# EAGLE board 200W_4FET_Load_v11 (EAGLE 6.1)
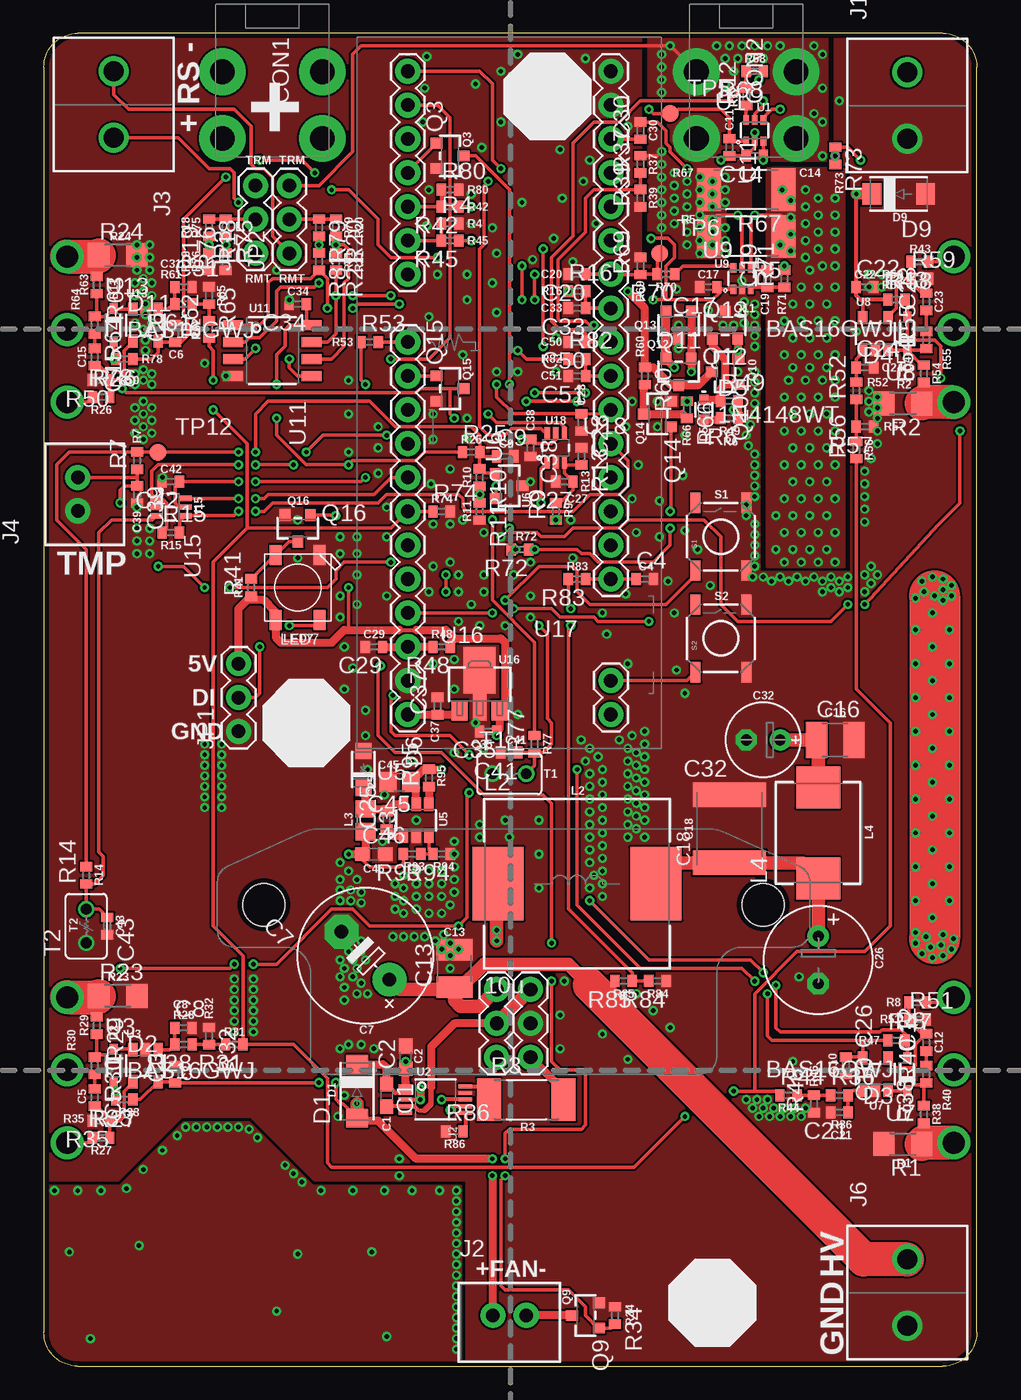
[diagram p1: board, top side]
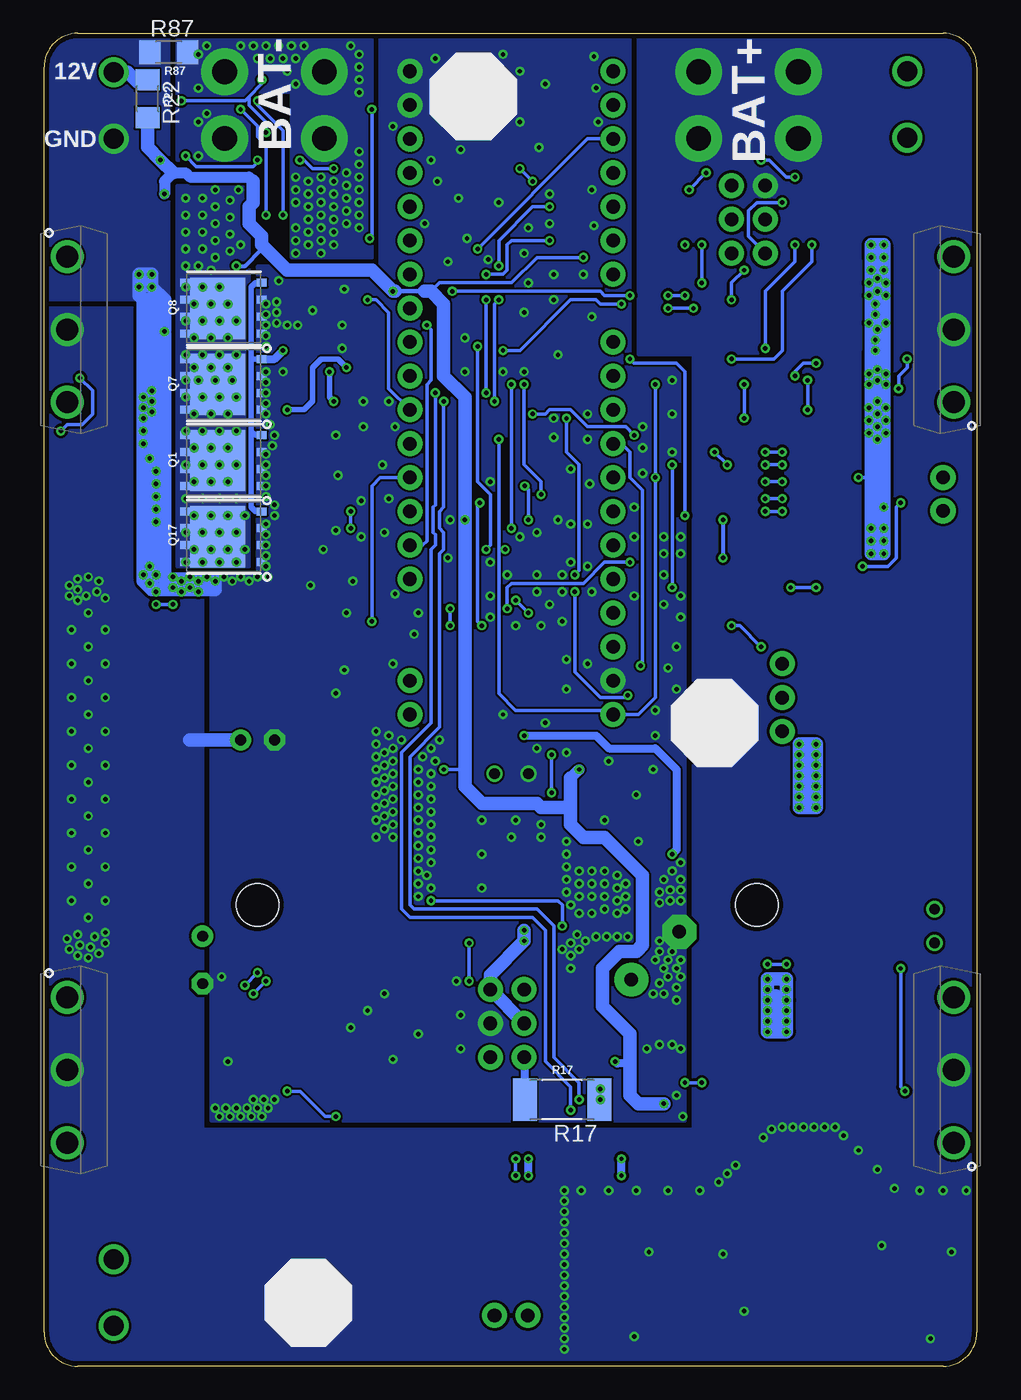
[diagram p2: board, bottom side, seen from below]

Size 70 x 100 mm. Coordinates in mm from the lower left corner, seen from the top.
Outline: 2.54,0 67.46,0 arc90 70,2.54 70,97.46 arc90 67.46,100 2.54,100 arc90 0,97.46 0,2.54 arc90 2.54,0
Copper layers (1*16): Top 0.0356mm / dielectric 1.5011mm / Bottom 0.0356mm
Design rules: minimum track width 6mil, minimum drill 13mil, track to track 6mil, track to pad 6mil, pad to pad 6mil, via to via 6mil, smd to smd 6mil, copper to edge 15mil, drill to drill 6mil, minimum pad ring 7mil, minimum via ring 7mil, stop-mask expansion 4mil, vias tented up to drill 20mil, thermal gap 10mil
Net classes: 1 100v: clearance 0.203 mm
Holes 3.17 mm at 37.78,95.25 19.68,48.26 50.16,4.76
tRestrict: area 47,1.6 to 53.3,7.9; area 16.5,45.1 to 22.9,51.4; area 34.6,92.1 to 41,98.4
bRestrict: area 47,1.6 to 53.3,7.9; area 16.5,45.1 to 22.9,51.4; area 34.6,92.1 to 41,98.4

## Footprints (pad centres in the part's own frame; a part is rotated, then mirrored left to right if it is on the bottom)
C0603 = smd 1.1 x 1: 1 -0.85,0; 2 0.85,0
C0402 = smd 0.7 x 0.9: 1 -0.65,0; 2 0.65,0
E5-10,5 = drill 1.016 pad 2.54: + -2.54,0 | drill 1.016 pad 2.54 octagon: - 2.54,0
C1210 = smd 1.6 x 2.7: 1 -1.4,0; 2 1.4,0
C2220K = smd 1.85 x 5.5: 1 -2.55,0; 2 2.55,0
E3,5-8 = drill 0.813 pad 1.6: + -1.778,0 | drill 0.813 pad 1.6 octagon: - 1.778,0
E2,5-6E = drill 0.813 pad 1.575: + -1.27,0 | drill 0.813 pad 1.575 octagon: - 1.27,0
C0805 = smd 1.3 x 1.5: 1 -0.85,0; 2 0.85,0
M4_RA_SOLDTERM = drill 1.85 pad 3.5: P$1 -2.5,3.745; P$2 2.5,3.745; P$3 2.5,-3.745; P$4 -2.5,-3.745
SMA = smd 1.4 x 1.64: A -2.015,0; K 2.015,0
SOD323 = smd 0.6 x 0.8: A 0,-1.25; K 0,1.25
SOD523 = smd 0.7 x 0.8: A 0,-0.75; K 0,0.75
SOD123W = smd 1.2 x 1.2: A -1.4,0; K 1.4,0
PHOENIXCONTACT1935161 = drill 1.5: 1 0,0; 2 5,0
B2B-XH-A = drill 1.016 pad 1.88: 1 -2.5,0; 2 0,0
DUAL_D2PAK_DB = drill 1.016 pad 1.88: D1 -1.27,2.54; D2 1.27,2.54; G1 -1.27,-2.54; G2 1.27,-2.54; S1 -1.27,0; S2 1.27,0 | hole 3.175: -18.733,8.89; 18.733,8.89
1X03 = drill 1.016 pad 1.88: 1 0,0; 2 2.54,0; 3 5.08,0
INDUCTOR_13.8X12.7 = smd 3.85 x 5.5: 1 -5.925,0; 2 5.925,0
0805 = smd 1.3 x 1.5: 1 -0.85,0; 2 0.85,0
INDUCTOR_7.4X6.6MM = smd 3.15 x 3.3: 1 -3.425,0; 2 3.425,0
WS2812B = smd 1.5 x 0.9: 1-VDD 2.45,-1.65; 2-DOUT 2.45,1.65; 3-GND -2.45,1.65; 4-DIN -2.45,-1.65
DFN5X6-8L = smd 0.6 x 0.75: 1 -1.905,-2.855; 2 -0.635,-2.855; 3 0.635,-2.855; 4 1.905,-2.855; EP-TL -0.635,2.895; EP-TLL -1.905,2.895; EP-TR 0.635,2.895; EP-TRR 1.905,2.895 | smd 4.6 x 4.12: EP 0,0.46
TO-247 = drill 1.65: 1 -5.46,0; 2 0,0; 3 5.46,0
SOT23 = smd 0.8 x 0.9: 1 0.95,1; 2 -0.95,1; 3 0,-1
R1206 = smd 1.6 x 1.803: 1 -1.422,0; 2 1.422,0
R2512 = smd 1.8 x 3.2: 1 -2.8,0; 2 2.8,0
R0402 = smd 0.7 x 0.9: 1 -0.65,0; 2 0.65,0
TACTILE_SWITCH_SMD = smd 1.524 x 0.762: 1 -2.54,1.905; 2 2.54,1.905; 3 -2.54,-1.905; 4 2.54,-1.905
THERMISTOR_3MMX3MM = drill 0.813: 1 -1.27,0; 2 1.27,0
TPAD_MED_ROUND = smd 1.27 x 1.27: 1 0,0
SOT-363 = smd 0.42 x 0.7: 1 -0.65,-0.8; 2 0,-0.8; 3 0.65,-0.8; 4 0.65,0.8; 5 0,0.8; 6 -0.65,0.8
10-TSSOP = smd 0.3 x 1: 1 -1,-2.25; 2 -0.5,-2.25; 3 0,-2.25; 4 0.5,-2.25; 5 1,-2.25; 6 1,2.25; 7 0.5,2.25; 8 0,2.25; 9 -0.5,2.25; 10 -1,2.25
SOT23-5 = smd 0.7 x 1: 1 0.95,1.2; 2 0,1.2; 3 -0.95,1.2; 4 -0.95,-1.2; 5 0.95,-1.2
SOT23-6 = smd 0.7 x 1: 1 -0.95,-1.2; 2 0,-1.2; 3 0.95,-1.2; 4 0.95,1.2; 5 0,1.2; 6 -0.95,1.2
8-SOIC = smd 0.75 x 1.5: 1 -1.905,-2.95; 2 -0.635,-2.95; 3 0.635,-2.95; 4 1.905,-2.95; 5 1.905,2.95; 6 0.635,2.95; 7 -0.635,2.95; 8 -1.905,2.95
SC70-6 = smd 0.4 x 0.9: 1 -0.65,-1.1; 2 0,-1.1; 3 0.65,-1.1; 4 0.65,1.1; 5 0,1.1; 6 -0.65,1.1
SOT-89 = smd 1.2 x 1.5: 1 -1.5,0; 3 1.5,0 | smd 1 x 2: 2 0,0.25 | smd 2.4 x 3.5: 2@1 0,3
STM32_BLUE_PILL_USABLE = drill 1.016 pad 1.88: 3V3 -7.62,-19.05; 3V3_2 7.62,24.13; 5V 7.62,19.05; A0 -7.62,13.97; A1 -7.62,11.43; A2 -7.62,8.89; A3 -7.62,6.35; A4 -7.62,3.81; A5 -7.62,1.27; A6 -7.62,-1.27; A7 -7.62,-3.81; A8 7.62,-13.97; A9 7.62,-11.43; A10 7.62,-8.89; A12 7.62,-3.81; A15 7.62,-1.27; B0 -7.62,-6.35; B1 -7.62,-8.89; B3 7.62,1.27; B4 7.62,3.81; B5 7.62,6.35; B6 7.62,8.89; B7 7.62,11.43; B8 7.62,13.97; B9 7.62,16.51; B10 -7.62,-11.43; B11 -7.62,-13.97; B12 7.62,-24.13; B13 7.62,-21.59; B14 7.62,-19.05; B15 7.62,-16.51; C13 -7.62,21.59; GND -7.62,-24.13; GND2 -7.62,-21.59; GND4 7.62,21.59; RST -7.62,-16.51; VBAT -7.62,24.13

## Placement (x,y rotation side)
C1  1u  [C0603]  25.72,20.32 270 top
C2  100n  [C0603]  27.15,23.18 90 top
C3  1u  [C0402]  9.84,21.91 90 top
C4  100n  [C0402]  45.09,59.05 0 top
C5  4.7n  [C0402]  3.81,20.16 270 top
C6  1u  [C0402]  9.84,77.47 90 top
C7  100u  [E5-10,5]  24.13,30.8 135 top
C8  100n  [C0402]  10.48,25.4 0 top
C9  1u  [C0402]  34.61,68.26 0 top
C10  1u  [C0402]  60.17,22.54 270 top
C11  1u  [C0402]  51.44,91.44 270 top
C12  4.7n  [C0402]  66.2,24.29 90 top
C13  2.2u  [C1210]  30.8,29.84 90 top
C14  1u  [C0402]  53.34,90.81 180 top
C15  4.7n  [C0402]  3.81,75.72 270 top
C16  2.2u  [C1210]  59.37,46.99 0 top
C17  1u  [C0402]  49.85,80.96 180 top
C18  10u  [C2220K]  51.44,40.32 90 top
C19  1u  [C0402]  54.29,81.6 90 top
C20  30n  [C0402]  40.01,81.92 180 top
C21  100n  [C0402]  59.69,19.05 180 top
C22  1u  [C0402]  61.59,80.96 0 top
C23  4.7n  [C0402]  66.2,79.85 90 top
C24  100n  [C0402]  61.59,74.93 0 top
C25  100n  [C0402]  25.72,40.96 90 top
C26  47u  [E3,5-8]  58.1,30.48 270 top
C27  1u  [C0402]  39.05,66.36 180 top
C28  4.7u  [C0402]  40.32,70.8 270 top
C29  1u  [C0402]  24.77,53.98 180 top
C30  1u  [C0402]  44.77,92.71 90 top
C31  100n  [C0402]  10.48,80.96 0 top
C32  22u  [E2,5-6E]  53.98,46.99 180 top
C33  100n  [C0402]  40.01,79.38 180 top
C34  1u  [C0402]  19.05,79.69 180 top
C35  1u  [C0402]  33.34,47.62 180 top
C37  1u  [C0402]  29.53,49.53 90 top
C38  1u  [C0402]  36.51,68.9 270 top
C39  1u  [C0402]  6.99,65.41 270 top
C41  1u  [C0402]  34.92,46.04 180 top
C42  DNI  [C0402]  9.53,66.36 180 top
C43  DNI  [C0402]  4.76,33.02 270 top
C45  22u  [C0805]  26.67,43.81 180 top
C46  22u  [C0603]  24.77,38.42 0 top
C50  30n  [C0402]  40.01,76.83 180 top
C51  100n  [C0402]  40.01,74.3 180 top
CON1  SOLDER_LUG  [M4_RA_SOLDTERM]  17.14,94.61 270 top
CON2  SOLDER_LUG  [M4_RA_SOLDTERM]  52.7,94.61 270 top
D1  SS54  [SMA]  23.5,20.64 90 top
D2  BAS16GWJ  [SOD323]  5.24,22.54 0 top
D3  BAS16GWJ  [SOD323]  64.77,21.91 180 top
D4  BAS16GWJ  [SOD323]  64.77,77.47 180 top
D5  1N4148WT  [SOD523]  49.53,71.75 0 top
D6  B5819W  [SOD123W]  23.97,44.77 270 top
D9  SS54  [SMA]  64.14,87.95 180 top
D11  BAS16GWJ  [SOD323]  5.24,78.11 0 top
J1  M02PT  [PHOENIXCONTACT1935161]  64.77,92.08 90 top
J2  M02  [B2B-XH-A]  36.2,3.81 0 top
J3  M02PT  [PHOENIXCONTACT1935161]  5.24,97.16 270 top
J4  M02  [B2B-XH-A]  2.54,66.67 90 top
J5  DUAL_D2PAK_DB  [DUAL_D2PAK_DB]  35.24,25.72 0 top
J6  M02PT  [PHOENIXCONTACT1935161]  64.77,3.02 90 top
JP1  [1X03]  14.61,47.62 90 top
JP2  [1X03]  18.41,83.5 90 top
JP3  [1X03]  15.88,83.5 90 top
L2  10u  [INDUCTOR_13.8X12.7]  40.01,36.2 0 top
L3  4.7u  [0805]  24.13,40.96 270 top
L4  1.5u  [INDUCTOR_7.4X6.6MM]  58.1,40.01 90 top
LED7  WS2812B  [WS2812B]  19.05,58.42 270 top
Q1  NCEP0160G  [DFN5X6-8L]  56.52,67.94 90 bottom
Q2  IRFP260N  [TO-247]  68.26,77.79 270 bottom
Q3  2N7002P  [SOT23]  30.48,90.81 90 top
Q4  IRFP260N  [TO-247]  68.26,22.23 270 bottom
Q5  IRFP260N  [TO-247]  1.75,22.23 90 bottom
Q6  IRFP260N  [TO-247]  1.75,77.79 90 bottom
Q7  NCEP0160G  [DFN5X6-8L]  56.52,73.66 90 bottom
Q8  NCEP0160G  [DFN5X6-8L]  56.52,79.38 90 bottom
Q9  2302  [SOT23]  40.64,3.81 270 top
Q10  8050M  [SOT23]  51.12,74.61 270 top
Q11  8550M  [SOT23]  51.12,78.11 180 top
Q12  8050M  [SOT23]  47.62,74.61 0 top
Q13  8550M  [SOT23]  47.62,78.11 0 top
Q14  2N7002P  [SOT23]  46.04,71.44 270 top
Q15  2N7002P  [SOT23]  30.48,73.34 90 top
Q16  2N7002P  [SOT23]  19.05,62.87 0 top
Q17  NCEP0160G  [DFN5X6-8L]  56.52,62.23 90 bottom
R1  5m  [R1206]  64.45,16.67 180 top
R2  5m  [R1206]  64.45,72.23 180 top
R3  7.5  [R2512]  36.2,20 0 top
R4  10k  [R0402]  30.48,85.72 0 top
R5  2m  [R2512]  52.7,84.77 180 top
R6  56  [R0402]  51.44,71.12 180 top
R7  10k  [R0402]  6.99,67.94 90 top
R8  750  [R0402]  65.56,27.3 180 top
R9  30k  [R0402]  38.42,64.14 90 top
R10  1.5k  [R0402]  32.7,66.67 270 top
R11  1.1k  [R0402]  32.7,64.14 270 top
R12  8.2k  [R0402]  52.7,95.25 90 top
R13  10k  [R0402]  40.32,68.26 270 top
R14  10k  [R0402]  3.17,36.83 90 top
R15  0  [R0402]  9.53,62.55 0 top
R16  1.6k  [R0402]  40.01,80.64 0 top
R17  7.5  [R2512]  31.11,20 180 bottom
R18  430k  [R0402]  12.38,85.41 270 top
R19  150k  [R0402]  12.38,82.87 90 top
R20  430k  [R0402]  21.91,85.41 270 top
R21  150k  [R0402]  21.91,82.87 270 top
R22  5A  [R1206]  62.23,95.09 270 bottom
R23  5m  [R1206]  5.56,27.78 0 top
R24  5m  [R1206]  5.56,83.34 0 top
R25  120  [R0402]  32.07,68.58 0 top
R26  750  [R0402]  4.29,72.71 0 top
R27  750  [R0402]  4.29,17.14 0 top
R28  10k  [R0402]  10.48,24.13 180 top
R29  10k  [R0402]  3.97,25.56 270 top
R30  10k  [R0402]  3.81,22.54 270 top
R31  30k  [R0402]  14.29,24.13 180 top
R32  510  [R0402]  12.38,24.77 270 top
R33  10k  [R0402]  6.03,20 180 top
R34  10k  [R0402]  42.86,3.81 270 top
R35  10k  [R0402]  4.29,18.41 180 top
R36  10k  [R0402]  59.69,20.32 0 top
R37  270k  [R0402]  44.77,90.17 90 top
R38  10k  [R0402]  66.04,18.89 90 top
R39  10k  [R0402]  44.77,87.63 90 top
R40  10k  [R0402]  66.2,21.91 90 top
R41  510  [R0402]  15.56,58.42 90 top
R42  0  [R0402]  30.48,87 180 top
R43  750  [R0402]  65.72,82.87 180 top
R44  30k  [R0402]  55.88,20.32 0 top
R45  0  [R0402]  30.48,84.45 180 top
R46  510  [R0402]  57.78,19.68 90 top
R47  10k  [R0402]  63.98,24.45 0 top
R48  10  [R0402]  29.84,53.98 180 top
R49  560  [R0402]  51.44,72.39 0 top
R50  10k  [R0402]  4.29,73.98 180 top
R51  10k  [R0402]  65.56,26.04 0 top
R52  10k  [R0402]  60.96,73.18 90 top
R53  1.6k  [R0402]  24.45,76.83 0 top
R54  10k  [R0402]  66.04,74.45 90 top
R55  10k  [R0402]  66.2,76.99 90 top
R56  30k  [R0402]  60.96,68.74 90 top
R57  510  [R0402]  61.59,70.48 180 top
R58  10k  [R0402]  63.98,80.01 0 top
R59  10k  [R0402]  65.72,81.6 0 top
R60  560  [R0402]  45.09,74.3 270 top
R61  10k  [R0402]  10.48,79.69 180 top
R62  30k  [R0402]  12.38,77.79 90 top
R63  10k  [R0402]  3.97,81.12 270 top
R64  10k  [R0402]  3.81,78.11 270 top
R65  510  [R0402]  12.38,80.33 270 top
R66  120  [R0402]  48.26,71.75 270 top
R67  2m  [R2512]  52.7,88.27 180 top
R68  15k  [R0402]  53.34,97.16 180 top
R69  15k  [R0402]  44.77,82.55 90 top
R70  8.2k  [R0402]  46.67,81.92 180 top
R71  1.5k  [R0402]  55.56,81.6 90 top
R72  10k  [R0402]  35.72,61.28 180 top
R73  1.5k  [R0402]  59.37,90.81 270 top
R74  10k  [R0402]  29.84,64.14 0 top
R75  4.3M  [R0402]  13.65,85.41 270 top
R76  150k  [R0402]  13.65,82.87 90 top
R77  10k  [R0402]  36.83,46.67 90 top
R78  10k  [R0402]  6.03,75.56 180 top
R79  4.3M  [R0402]  20.64,85.41 270 top
R80  10k  [R0402]  30.48,88.27 0 top
R81  150k  [R0402]  20.64,82.87 270 top
R82  1.6k  [R0402]  40.01,75.56 0 top
R83  1.6k  [R0402]  40.01,59.05 180 top
R84  10k  [R0402]  46.04,28.89 180 top
R85  270k  [R0402]  43.5,28.89 180 top
R86  47k  [R0402]  30.8,17.62 0 top
R87  10k  [R1206]  60.64,98.58 0 bottom
R93  51k  [R0402]  27.62,38.42 180 top
R94  10k  [R0402]  29.84,38.42 180 top
R95  150k  [R0402]  28.89,44.13 90 top
S1  [TACTILE_SWITCH_SMD]  50.8,62.23 90 top
S2  [TACTILE_SWITCH_SMD]  50.8,54.61 90 top
T1  NTC3MM  [THERMISTOR_3MMX3MM]  34.92,44.45 0 top
T2  NTC3MM  [THERMISTOR_3MMX3MM]  3.17,33.02 90 top
TP5  TPADMED_ROUND  [TPAD_MED_ROUND]  46.99,93.98 0 top
TP6  TPADMED_ROUND  [TPAD_MED_ROUND]  46.2,83.5 0 top
TP12  TPADMED_ROUND  [TPAD_MED_ROUND]  8.57,68.58 0 top
U1  NCS199A2  [SOT-363]  53.34,92.71 0 top
U2  LM5106  [10-TSSOP]  29.37,20 270 top
U3  LM321-TR  [SOT23-5]  7.62,22.54 0 top
U5  MP2359  [SOT23-6]  27.94,40.96 0 top
U6  TL431SOT23  [SOT23]  34.92,66.04 90 top
U7  LM321-TR  [SOT23-5]  62.39,21.91 180 top
U8  LM321-TR  [SOT23-5]  62.39,77.47 180 top
U9  NCS199A3  [SOT-363]  52.39,81.6 0 top
U11  MCP6002SOIC  [8-SOIC]  17.14,76.2 270 top
U13  LM321-TR  [SOT23-5]  7.62,78.11 0 top
U15  DNI  [SC70-6]  9.53,64.45 270 top
U16  3.3V  [SOT-89]  32.7,49.21 0 top
U17  STM32_BLUE_PILL  [STM32_BLUE_PILL_USABLE]  34.92,73.03 180 top
U18  74LVC1G3157  [SC70-6]  38.42,68.9 0 top

## Tracks (layer width: path | path; a pad name or v marks a point on that pad's centre or on a via)
2V495  (via drill 0.33)
  Top 0.254: C9.1 33.03,68.26 R25.2 | U6.2 v33.92,66.04 U6.1 33.04,66.99 R10.1 32.7,68.58 R25.2 | R14.2 3.17,61.28 0.95,63.5 0.95,67.63 1.91,68.58 6.97,68.58 R7.2 8.56,68.59 TP12.1 v14.61,68.58 | R77.2 36.83,54.29 33.66,57.47 v33.66,63.5 | v15.88,68.58 15.88,71.44 16.83,72.39 24.45,72.39 26.35,70.48 32.07,70.48 32.72,69.83 R25.2
  Bottom 0.254: v33.66,63.5 33.66,65.77 v33.92,66.04 | v14.61,68.58 v15.88,68.58
3V3  (via drill 0.33)
  Top 0.254: U15.5 10.16,64.45 9.84,64.77 9.84,66.03 C42.1 v14.61,66.36 | U18.5 38.42,69.53 38.1,69.22 36.84,69.22 C38.1 35.89,69.55 v35.88,69.53 | R53.1 23.8,73.99 v24.13,73.66 | v15.88,66.36 23.81,66.36 v24.13,66.67 | R72.2 v35.4,61.28
  Top 0.61: U17.3V3_2 29.51,48.9 C37.1 30.87,48.88 U16.1
  Bottom 0.254: v35.88,69.53 35.88,61.28 | v14.61,66.36 v15.88,66.36 | v24.13,73.66 v24.13,66.67 24.13,50.16 25.4,48.9 U17.3V3_2 27.62,49.21 34.61,49.21 35.88,50.48 35.88,60.96 35.88,61.28 | v35.4,61.28 35.88,61.28
3V3-2
  Top 0.254: C30.1 42.56,92.06 U17.3V3
5V  (via drill 0.33)
  Top 0.254: R93.2 26.97,37.77 26.67,37.47 24.45,37.47 23.91,38 C46.1 | C34.1 19.7,78.5 U11.8 18.41,78.11 18.1,77.79 18.1,76.52 17.46,75.88 v17.46,73.66 | v17.46,71.12 17.46,69.85 19.68,67.63 v22.86,67.63 23.18,67.94 27.94,67.94 28.57,68.58 R25.1 | v22.86,58.42 22.86,55.24 | 15.56,57.78 R41.1
  Top 0.305: 26.67,55.24 27.94,55.24
  Top 0.61: L3.2 24.13,38.63 C46.1 v22.86,38.42 | R48.1 30.5,54.31 30.8,54.61 | 30.8,54.61 34.29,54.61 34.61,54.29 34.61,49.62 U16.3 34.2,47.84 C35.1 33.99,47.32 v33.97,47.31 | 26.67,55.24 22.86,55.24 22.54,55.24 21.59,54.29 17.78,54.29 17.4,54.67 LED7.1-VDD 17.4,56.58 16.51,57.47 15.26,57.47 | 27.94,55.24 30.16,55.24 30.8,54.61 | JP1.3 14.61,56.83 15.24,57.47 15.26,57.47 | 15.26,57.47 R41.1
  Bottom 0.254: v17.46,73.66 v17.46,71.12 | v22.86,67.63 v22.86,58.42
  Bottom 0.61: v33.97,47.31 28.57,47.31 27.62,46.35 24.13,46.35 22.54,44.77 22.54,38.73 v22.86,38.42
5V_USB
  Top 0.61: R48.2 U17.5V C29.1
7V4_SNS
  Top 0.254: R9.2 38.75,64.78 39.7,65.74 C27.1 39.07,66.99 U18.3 39.25,67.61 R13.2
12V  (via drill 0.33)
  Top 0.254: R73.1 60.31,91.45 v61.28,90.49 | D1.A 22.43,19.68 22.23,19.68 21.91,20 v21.91,21.27 | R47.1 61.44,24.45 | 61.44,24.45 54.61,24.45 54.29,24.77 v54.29,27.94 | v53.34,28.89 52.39,29.84 44.77,29.84 40.01,34.61 v40.01,44.77 | v13.65,89.22 10.48,86.04 10.48,78.9 10.79,78.58 10.79,77.31 10.3,76.82 C6.1 8.65,76.82 U13.5 | v16.19,90.49 19.37,90.49 v20.32,89.53 | v21.59,88.27 22.86,88.27 25.08,86.04 25.08,84.14 26.04,83.19 v29.53,83.19 | R9.1 v38.42,63.5 | 9.84,21.27 10.16,21.27 | 10.16,21.27 v20.64,21.27 | U13.5 8.49,76.91 | R78.1 8.1,75.56 8.57,76.04 U13.5 | 10.16,21.27 10.14,21.26 C3.1 9.76,21.34 U3.5 7.23,20 R33.1 | C10.1 61.35,23.19 U7.5 61.44,24.45 | U8.5 61.44,79.85 61.59,80.01 | C22.1 60.95,81.27 60.96,81.28 | R58.1 63.18,80.01
  Top 0.305: R71.2 v55.56,82.55 | 63.18,80.01 61.59,80.01 61.28,80.01 60.96,80.33 60.96,81.28 v60.96,87.95 | U2.1 27.12,21.09 27.15,21.27
  Top 0.61: Q10.3 49.12,73.61 Q12.3 47.04,73.61 45.7,74.94 R60.1 45.09,79.38 v43.81,80.64 | U5.5 27.94,43.4 C45.1 28.49,44.78 R95.2 29.83,44.78 v29.84,44.77 | J2.1 33.7,14.25 v33.66,14.29 | v33.66,15.56 27.94,15.56 25.08,18.41 23.7,18.41 D1.A | 27.15,21.27 C2.1 | C2.1 27.15,22.38 | v27.15,22.86 C2.1
  Top 0.813: D9.K v60.96,87.95
  Top 1.016: v23.5,19.68 D1.A
  Bottom 0.254: v20.64,21.27 v21.91,21.27 | v54.29,27.94 v53.34,28.89 | v13.65,89.22 14.29,89.22 15.56,90.49 v16.19,90.49 | v20.32,89.53 v21.59,88.27 | v29.53,83.19 33.02,83.19 34.92,81.28 40.32,81.28 40.96,80.64 | v40.01,44.77 38.42,44.77
  Bottom 0.305: v55.56,82.55 54.93,82.55 53.66,83.82 53.66,84.14
  Bottom 0.356: 43.66,80.64 41.43,80.64
  Bottom 0.61: v33.66,14.29 v33.66,15.56 | 26.04,20.32 26.04,22.54 26.19,22.7 26.99,22.7 v27.15,22.86
  Bottom 0.813: 54.29,88.9 54.61,89.22 59.05,89.22 59.37,89.53 60.33,89.53 60.96,88.9 v60.96,87.95 | 30.48,44.13 v29.84,44.77
  Bottom 1.016: R22.2 62.23,91.44 v61.28,90.49 60.33,89.53 | 54.29,88.9 54.29,87.31 54.61,87 54.61,85.72 53.66,84.77 53.66,84.14 51.75,82.23 45.4,82.23 v43.81,80.64 43.66,80.64 | 41.43,80.64 40.96,80.64 40.01,79.69 40.01,74.3 38.42,72.71 v38.42,63.5 38.42,44.77 38.42,43.5 37.15,42.23 33.02,42.23 32.7,41.91 30.48,41.91 | v23.5,19.68 25.4,19.68 26.04,20.32 26.04,24.92 28.1,26.99 28.1,29.84 26.83,31.11 25.56,31.11 25.08,31.59 25.08,36.83 27.94,39.69 29.53,39.69 30.48,40.64 30.48,41.91 | 30.48,41.91 30.48,44.13
A0
  Top 0.254: R83.1 U17.A0 C4.1
AUX_SNS  (via drill 0.33)
  Top 0.254: R15.2 10.18,63.35 U15.4 14.27,63.8 v14.61,64.14 | v15.88,64.14 16.51,64.14 17.14,64.77 25.08,64.77 25.72,65.41 31.11,65.41 31.43,65.09 31.43,64.45 31.75,64.14 39.69,64.14 40.96,65.41 43.18,65.41 43.81,66.04 43.81,67.94 U17.A4
  Bottom 0.254: v14.61,64.14 v15.88,64.14
AUX_SNS_INT  (via drill 0.33)
  Top 0.254: U15.1 8.88,65.1 9.21,64.77 9.21,62.87 R15.1 | U18.4 39.07,70.47 38.73,70.8 33.97,70.8 v33.34,71.44 | v25.72,69.85 20.95,69.85 v19.68,68.58 | v18.73,67.63 v15.88,67.63 | v14.61,67.63 8.57,67.63 8.1,67.15 8.1,65.43 U15.1 | 8.26,65.27 U15.1
  Bottom 0.254: v25.72,69.85 26.35,70.48 29.21,70.48 30.48,71.75 32.07,71.75 32.38,71.44 v33.34,71.44 | v19.68,68.58 v18.73,67.63 | v15.88,67.63 v14.61,67.63
BASE1  (via drill 0.33)
  Top 0.61: Q13.1 Q12.1 48.58,76.52 v48.58,74.61 | v48.26,72.39 R66.1
  Bottom 0.406: v48.58,74.61 48.58,72.71 v48.26,72.39
BASE2
  Top 0.61: D5.K 50.67,72.5 R49.1 50.78,73.33 51.12,73.66 | Q10.1 51.12,73.66 | Q11.1 50.17,76.52 51.12,75.56 51.12,73.67 51.12,73.66
BEN  (via drill 0.33)
  Top 0.254: v40.64,73.03 v36.83,73.03 | v36.83,80.01 v36.83,81.92 | v32.07,84.45 R45.1
  Top 0.305: U2.7 30.77,19.5 v30.48,19.21
  Bottom 0.254: v30.48,19.21 30.48,20.95 32.38,22.86 32.38,32.7 33.34,33.66 42.55,33.66 43.18,34.29 43.18,46.04 40.96,48.26 40.96,61.28 40.64,61.59 40.64,62.39 40.8,62.55 40.8,64.45 40.64,64.61 v40.64,73.03 | v36.83,73.03 v36.83,80.01 | v36.83,81.92 35.56,81.92 35.24,82.23 35.24,84.14 34.92,84.45 v32.07,84.45
C1+  (via drill 0.33)
  Top 1.016: L4.2 58.1,46.86 C16.1 C32.+
  Top 3.81: v66.83,57.78 66.83,32.07
  Bottom 1.016: C32.+ 59.05,46.99
  other vias: 0.79,13.18 10.64,17.94 11.43,17.94 12.22,17.94 13.02,17.94 13.81,17.94 14.61,17.94 15.4,17.78 16.03,17.14 10,17.3 2.54,13.18 4.29,13.18 6.19,13.34 7.46,14.76 8.89,16.19 18.1,15.08 18.73,14.45 19.37,13.81 20.8,13.18 23.18,13.18 25.56,13.18 27.62,13.18 29.69,13.18 30.96,13.18 30.96,12.38 30.96,11.59 30.96,10.79 30.96,10 30.96,9.21 30.96,8.41 30.96,7.62 30.96,6.83 30.96,6.03 30.96,5.24 30.96,4.45 30.96,3.65 30.96,2.86 30.96,2.06 30.96,1.27 25.72,2.22 3.49,2.06 1.91,8.57 24.61,8.57 7.14,9.05 17.46,4.13 19.05,8.41 65.41,31.75 65.88,30.96 66.67,30.64 67.47,30.8 68.1,31.27 68.26,32.07 65.41,32.54 66.52,31.43 67.31,31.59 66.2,32.23 67.47,32.38 66.67,33.66 67.94,34.92 65.41,34.92 66.67,36.2 66.67,38.73 66.67,41.27 66.67,43.81 66.67,46.35 66.67,48.9 66.67,51.44 66.67,53.98 66.67,56.52 67.94,37.47 65.41,37.47 65.41,40.01 67.94,40.01 67.94,42.55 65.41,42.55 65.41,45.09 67.94,45.09 67.94,47.62 65.41,47.62 65.41,50.16 67.94,50.16 67.94,52.7 65.41,52.7 65.41,55.24 67.94,55.24 65.41,57.63 68.1,57.78 66.67,59.21 65.88,58.9 67.47,59.05 66.04,58.1 67.47,57.47 67.47,58.26 68.1,58.58
  pour Bottom (no thermals): 0,100.01 25.4,100.01 25.4,75.88 21.27,75.88 21.27,17.78 58.1,17.78 58.1,65.09 60.64,65.09 60.64,79.38 70.17,79.38 70.17,0 0,0
  pour Top: 0,13.49 5.71,13.49 10.48,18.26 15.4,18.26 20.16,13.49 31.27,13.49 31.27,0 0,0
C1-  (via drill 0.33)
  Top 0.254: U9.5 52.39,86.04 v52.07,86.36 50.48,86.36 | U1.5 53.34,93.98 53.98,94.61 v53.98,94.93 | JP2.3 20.64,88.58 23.18,91.12 23.18,98.42 23.81,99.06 47.02,99.06 CON2.P$4 | R37.2 46.05,90.82 v46.35,91.12
  Bottom 0.254: v53.98,94.93 53.98,94.61 52.07,92.71 v52.07,86.36
  other vias: 51.12,83.5 51.12,84.45 51.12,85.41 51.12,87.31 51.12,88.27 51.12,89.22 50.16,88.9 50.16,87.95 50.16,87 50.16,84.14 50.16,85.09 50.16,86.04 49.21,83.5 49.21,84.45 49.21,85.41 49.21,86.36 49.21,87.31 49.21,88.27 49.21,89.22 48.26,84.14 48.26,85.09 48.26,86.04 48.26,87 48.26,87.95 48.26,88.9 47.31,85.72 47.31,86.68 47.31,87.63 47.31,88.58 47.31,89.53 46.35,85.41 46.35,86.36 46.35,87.31 46.35,88.27 46.35,89.22 46.35,90.17 46.35,95.57 46.35,96.52 46.35,97.47 46.35,98.42 46.99,99.06 50.48,99.06 51.44,99.06 52.39,99.06 53.34,99.06 54.29,99.06 55.24,99.06 57.78,99.06 58.42,98.42 58.42,95.89 58.42,93.34 58.42,90.81 57.78,93.98 51.12,98.11 52.07,98.11 53.02,98.11 53.98,98.11 51.75,97.16 51.12,96.2
  pour Top (no thermals): 45.4,100.01 58.74,100.01 58.74,90.49 54.61,90.49 54.61,95.57 53.02,95.57 53.02,87 51.12,87 51.12,83.19 45.4,83.19
  pour Bottom (no thermals): 45.4,100.01 60.01,100.01 60.01,90.49 54.61,90.49 54.61,95.57 51.44,95.57 51.44,83.19 45.4,83.19
C1-R  (via drill 0.33)
  Top 0.254: U9.4 53.04,86.06 v53.34,86.36 55.24,86.36 | U1.4 53.99,93.68 54.61,94.3 v55.24,94.3
  Bottom 0.254: v55.24,94.3 53.98,93.03 53.98,92.23 53.34,91.6 v53.34,86.36
  other vias: 57.15,88.27 59.37,87.63 57.15,87 59.37,86.36 57.15,85.72 59.37,85.09 57.15,84.45 59.37,83.82 57.15,83.19 59.37,82.55 58.42,82.55 58.1,83.82 58.1,85.09 58.1,86.36 58.1,87.63 56.2,66.36 57.47,66.36 55.56,67.63 56.83,67.63 58.1,67.63 56.2,68.9 57.47,68.9 56.83,70.17 58.1,70.17 55.56,70.17 56.2,71.44 57.47,71.44 58.1,72.71 56.83,72.71 55.56,72.71 55.88,73.98 57.15,73.98 56.2,74.93 55.56,78.42 56.83,78.42 58.1,78.42 56.2,79.69 57.47,79.69 56.83,80.96 58.1,80.96 58.74,79.69 58.42,73.98 58.74,71.44 58.74,68.9 58.74,66.36 57.47,82.23 59.37,80.96 59.37,78.42 56.2,77.15 57.47,77.15 58.74,77.15 56.83,75.88 58.1,75.88 59.37,75.88 55.56,75.88 57.47,74.93 58.74,74.93 59.37,73.98 59.37,72.71 59.37,70.17 59.37,67.63 54.93,63.82 56.2,63.82 57.47,63.82 58.74,63.82 55.56,65.09 56.83,65.09 58.1,65.09 59.37,65.09 54.93,61.28 56.2,61.28 57.47,61.28 58.74,61.28 55.56,62.55 56.83,62.55 58.1,62.55 59.37,62.55 55.56,60.33 56.83,60.33 58.1,60.33 59.37,60.33 56.04,83.66 56.04,84.93 56.04,86.2 56.04,87.47 55.4,88.27 55.24,84.14
  pour Bottom (no thermals): 54.61,88.58 60.01,88.58 60.01,60.01 54.61,60.01
  pour Top (no thermals): 54.29,89.85 60.01,89.85 60.01,60.01 54.29,60.01
C1A
  Top 0.254: C20.1 U17.B1 42.56,81.9 R69.1 44.78,81.92 R70.2 46.04,81.93 46.04,83.34 TP6.1
C1A_HI
  Top 0.254: U17.A7 C50.1 40.64,76.85 40.64,77.47 40.32,77.79 38.73,77.79 38.1,78.42 38.1,83.19 39.69,84.77 39.69,91.76 41.27,93.34 43.18,93.34 44.77,94.93 51.44,94.93 52.4,95.9 R12.2 52.69,95.92 R68.2
C1CCPWM  (via drill 0.33)
  Top 0.254: R74.1 U17.B6 26.04,62.87 15.24,62.87 | 15.24,62.87 12.7,60.33 12.7,33.02 14.94,30.78 R31.1 18.73,24.13 21.27,21.59 21.27,15.24 21.59,14.92 44.29,14.92 v48.1,18.73 | 15.24,62.87 15.24,69.22 v12.7,71.75 | v12.7,73.98 12.7,76.2 12.38,76.52 R62.1 | v51.75,20.64 53.34,20.64 | 53.34,20.64 54.91,20.64 R44.1 | R56.1 60.96,50.8 63.5,48.26 63.5,33.02 61.59,31.11 56.52,31.11 53.34,27.94 53.34,20.64
  Bottom 0.254: v12.7,71.75 v12.7,73.98 | v48.1,18.73 48.9,18.73 50.8,20.64 v51.75,20.64
C1CCSET1
  Top 0.254: C24.1 R52.2 60.96,75.56 61.44,76.04 U8.1
C1CCSET2
  Top 0.254: R36.2 | C21.1 R36.2 | U7.1 60.73,20.71 R36.2
C1CCSET3
  Top 0.254: R28.2 | C8.1 R28.2 | U3.1 9.44,23.74 R28.2
C1CCSET4
  Top 0.254: R61.2 | C31.1 R61.2 | U13.1 9.3,79.31 9.68,79.69 R61.2
C1DFB1
  Top 0.254: R54.1 66.04,72.4 R2.1
  Top 2.54: Q2.3 65.97,72.33 R2.1
C1DFB2
  Top 0.254: R38.1 66.04,16.83 R1.1
  Top 2.54: Q4.3 65.97,16.77 R1.1
C1DFB3
  Top 0.254: R29.1 3.97,27.62 R23.1
  Top 2.54: Q5.3 4.04,27.68 R23.1
C1DFB4
  Top 0.254: R24.1 4.13,81.94 R63.1
  Top 2.54: Q6.3 4.04,83.25 R24.1
C1DOFF  (via drill 0.33)
  Top 0.254: v61.59,57.15 67.15,63.18 68.74,64.77 v68.74,70.17 | v34.92,73.66 34.92,88.27 32.38,90.81 Q3.3 | v34.92,62.87 35.24,62.55 36.99,62.55 37.31,62.23 39.05,62.23 39.69,62.87 43.18,62.87 43.81,63.5 49.53,63.5 50.8,62.23 50.8,57.15 52.07,55.88 59.05,55.88 v60.33,57.15 | v67.31,74.14 67.31,76.52 66.83,76.99 65.09,76.99 64.77,77.31 D4.A 64.77,79.87 R58.2
  Bottom 0.254: v61.59,57.15 v60.33,57.15 | v34.92,62.87 v34.92,73.66 | v68.74,70.17 68.26,70.64 67.15,70.64 66.36,71.44 66.36,73.18 v67.31,74.14
C1DOFFG
  Top 0.254: U17.B15 27.3,89.58 Q3.1
C1FET  (via drill 0.33)
  Top 0.61: Q11.2 v52.07,76.2 52.07,75.61 Q10.2
  Bottom 0.406: Q8.4 54.13,81.28 54.45,80.96 54.45,75.56 | Q7.4 54.45,75.56 | 54.45,70.17 54.45,75.56 | Q1.4 54.13,69.85 54.45,70.17 | 54.45,70.17 54.45,64.45 54.13,64.14 Q17.4
  Bottom 0.61: Q7.4 52.7,75.56 v52.07,76.2
C1NGATE1
  Top 0.254: R59.1 R43.2 | C23.2 65.87,80.5 65.07,81.3 R59.1 | U8.4 63.34,78.74 63.98,79.38 63.98,81.28 64.29,81.6 R59.1
C1NGATE2
  Top 0.254: R8.2 R51.1 64.91,25.89 65.87,24.94 C12.2 66.2,24.92 65.41,24.13 65.41,22.54 65.25,22.38 63.98,22.38 63.34,23.02 U7.4
C1NGATE3
  Top 0.254: R27.2 R35.1 | C5.2 3.98,19.51 4.94,18.56 R35.1 | U3.4 6.67,21.27 6.03,20.64 6.03,18.73 5.71,18.41 R35.1
C1NGATE4
  Top 0.254: U13.4 6.67,76.84 6.03,76.2 6.03,74.45 5.56,73.98 R50.1 | R50.1 R26.2 | C15.2 4.14,75.07 4.76,74.45 4.76,74.15 R50.1
C1ON  (via drill 0.33)
  Top 0.254: v37.47,83.82 v37.47,76.52 | v46.99,62.87 46.99,61.59 45.72,60.33 41.59,60.33 40.96,60.96 40.32,60.96 40.01,61.28 v36.83,61.28 R72.1 | v46.99,64.14 47.04,64.14 Q14.1
  Top 0.61: 47.01,70.45 Q14.1
  Bottom 0.254: U17.B14 29.21,92.08 v37.47,83.82 | v37.47,76.52 37.47,66.36 36.51,65.41 36.51,61.59 v36.83,61.28 | v46.99,62.87 v46.99,64.14
C1R  (via drill 0.33)
  Top 0.254: R37.1 R39.2 44.77,88.27 41.27,88.27 40.64,87.63 40.64,85.09 38.58,83.03 38.58,78.58 38.73,78.42 40.64,78.42 40.96,78.11 v41.27,78.11
  Bottom 0.254: U17.A1 41.59,61.59 41.27,61.91 41.27,73.66 40.96,73.98 40.96,77.79 v41.27,78.11
C1TH  (via drill 0.33)
  Top 0.254: R7.1 6.99,66.67 | 6.99,66.67 C39.1 6.97,66.04 6.03,66.04 5.71,65.72 v5.71,64.77 | J4.2 6.99,66.67 | v35.24,56.83 38.1,56.83 38.73,56.2 41.27,56.2 41.59,55.88 v45.4,55.88 | v26.04,60.33 22.54,60.33 21.91,59.69 21.91,59.05 21.27,58.42 v13.97,58.42 | v12.06,58.42 10.48,60.01 v8.57,60.01
  Bottom 0.254: U17.A3 44.77,66.67 45.4,66.04 v45.4,55.88 | v35.24,56.83 35.24,58.42 34.92,58.74 29.53,58.74 27.94,60.33 v26.04,60.33 | v13.97,58.42 v12.06,58.42 | v5.71,64.77 6.03,64.45 6.03,60.64 6.67,60.01 v8.57,60.01
C1V
  Top 0.254: U17.B0 C33.1 R16.2
C1V_HI
  Top 0.254: R82.2 C51.1 U17.A6
C1V_OA  (via drill 0.33)
  Top 0.254: R21.2 v21.91,80.33 21.91,77.47 21.27,76.83 U11.7 | R16.1 v39.37,80.64 | v26.04,80.33 v23.18,80.33
  Bottom 0.254: v39.37,80.64 28.26,80.64 27.94,80.33 v26.04,80.33 | v23.18,80.33 v21.91,80.33
C1V_OA1  (via drill 0.33)
  Top 0.254: R82.1 36.2,75.56 v35.56,76.2 | v26.67,79.69 23.5,79.69 v23.18,79.38 | v21.27,79.38 21.27,81.58 R81.2 20.02,81.6 17.14,81.6 16.83,81.28 16.83,78.74 16.19,78.11 U11.1
  Bottom 0.254: v35.56,76.2 34.29,76.2 30.48,80.01 28.57,80.01 28.26,79.69 v26.67,79.69 | v23.18,79.38 v21.27,79.38
C1VFBN
  Top 0.254: R64.2 C15.1 3.81,76.2
C1VFBN1
  Top 0.254: R30.2 C5.1
C1VFBN2
  Top 0.254: C12.1 R40.2
C1VFBN3
  Top 0.254: R55.2 C23.1
C2DOFF  (via drill 0.33)
  Top 0.254: v5.87,73.34 6.19,73.03 27.94,73.03 28.26,73.34 30.48,73.34 | v5.71,29.84 13.97,29.84 v14.29,30.16 | v15.72,30.16 17.46,30.16 21.59,34.29 23.18,34.29 24.45,33.02 v31.11,33.02 31.75,33.66 31.75,42.86 v31.91,43.02 | v40.96,34.92 45.4,30.48 53.02,30.48 v53.98,29.53 | Q15.3 30.48,73.34 | 30.48,73.34 30.48,71.44 v30.8,71.12 | v30.16,59.37 v30.16,58.1 | v31.91,45.88 30.48,47.31 26.35,47.31 26.04,47.62 26.04,50.16 v26.19,50.32 | v54.93,28.57 54.93,25.4 55.24,25.08 62.71,25.08 62.87,25.24 64.29,25.24 64.77,24.77 64.77,24.43 | D11.A 5.24,75.71 R78.2 5.38,75.42 v5.24,75.56 | R33.2 5.38,20.65 | D2.A 5.38,21.15 5.38,20.65 | 5.38,20.65 v5.4,20.64 | D3.A 64.77,24.43 | 64.77,24.43 R47.2
  Bottom 0.254: v14.29,30.16 v15.72,30.16 | v31.11,33.02 31.11,34.61 31.43,34.92 v40.96,34.92 | v53.98,29.53 v54.93,28.57 | v30.8,71.12 30.8,68.58 29.84,67.63 29.84,59.69 v30.16,59.37 | v30.16,58.1 30.16,52.07 28.26,50.16 26.35,50.16 v26.19,50.32 | v31.91,45.88 v31.91,43.02 | v5.24,75.56 5.24,74.93 5.87,74.3 v5.87,73.34 | v5.71,29.84 5.71,20.95 v5.4,20.64
C2DOFFG
  Top 0.254: U17.A15 Q15.1
DI  (via drill 0.33)
  Top 0.254: Q16.1 21.86,63.87 v21.91,63.82 | v26.04,75.56 28.89,75.56 30.48,77.15 30.48,93.66 29.53,94.61 U17.B13
  Bottom 0.254: v21.91,63.82 21.91,74.61 22.54,75.25 25.72,75.25 v26.04,75.56
DI1
  Top 0.254: Q16.3 18.39,61.87 LED7.4-DIN 17.36,60.87 R41.2
DI2  (via drill 0.33)
  Top 0.254: v18.41,55.56 20.32,55.56 20.7,55.94 LED7.2-DOUT | v16.19,53.98 16.19,50.48 15.88,50.16 JP1.2
  Bottom 0.254: v18.41,55.56 17.78,55.56 v16.19,53.98
FANON  (via drill 0.33)
  Top 0.254: R34.2 42.56,2.86 Q9.1 | Q9.1 41.59,2.86 | 41.59,2.86 40.64,3.81 40.64,4.45 39.37,5.71 34.61,5.71 34.29,6.03 34.29,13.97 v34.61,14.29 | Q9.1 41.59,2.86 | v34.61,15.56 34.61,17.46 34.92,17.78 40.32,17.78 40.64,18.1 40.64,21.91 40.32,22.23 38.73,22.23 38.1,22.86 v38.1,28.89 | v38.1,31.75 38.1,42.23 37.47,42.86 33.02,42.86 29.84,46.04 26.35,46.04 25.08,47.31 25.08,52.39 v25.24,52.55
  Bottom 0.254: v34.61,14.29 v34.61,15.56 | v38.1,28.89 v38.1,31.75 | U17.B4 26.67,69.22 26.04,68.58 26.04,66.67 25.08,65.72 25.08,52.7 v25.24,52.55
GND  (via drill 0.33)
  Top 0.254: 51.45,90.81 C14.2 53.34,91.45 U1.2 v53.34,92.55 | 51.45,90.81 C11.2 | R68.1 53.99,96.85 v53.66,96.52 | U11.4 14.2,74.2 v13.65,74.3 | C34.2 18.4,80 v18.41,80.01 | 51.45,90.81 51.12,90.81 v50.8,90.49 | v48.26,89.85 46.99,91.12 46.99,91.44 46.67,91.76 46.67,92.71 46.04,93.34 44.77,93.34 | C42.2 v8.89,66.67
  Top 0.305: C19.2 53.67,82.25 53.66,82.23
  Bottom 0.254: v53.66,96.52 53.66,96.2 54.61,95.25 | 54.61,95.25 54.61,94.61 53.34,93.34 v53.34,92.55 | 54.61,95.25 54.93,94.93 v59.69,94.93 | v13.65,74.3 13.65,74.61 13.02,75.25 v12.06,75.25 | v18.41,80.01 18.41,81.28 v17.46,82.23 | v50.8,90.49 50.48,90.49 49.85,89.85 v48.26,89.85 | v8.89,66.67 8.26,66.67 7.94,75.88 | 61.91,79.69 61.59,79.69 v60.96,77.63 | v61.91,73.18 62.07,73.18 61.91,73.66
  Bottom 0.305: v19.05,63.5 v19.05,60.64
  Bottom 0.61: v26.67,14.29 v26.67,15.56
  Bottom 0.813: v61.91,80.96 v62.87,80.96
  Bottom 1.016: v6.99,83.19 v7.94,83.19 | v7.94,83.19 v7.94,84.14 v6.99,84.14 v6.99,83.19 | v6.99,83.19 v6.99,64.45 v6.99,61.91 | v6.99,61.91 v6.99,60.96 v7.94,60.96 v7.94,61.91 | v6.99,61.91 v7.94,61.91 | v7.94,61.91 7.94,75.88 | 60.96,70.8 v60.96,77.63 60.96,80.01 v61.91,80.96 v61.91,81.92 v62.87,81.92 v62.87,80.96 62.87,80.33 62.55,80.01 | 60.96,70.8 v62.55,70.17 v62.55,69.22 | v62.55,69.22 62.55,58.9 61.91,58.26 | v62.55,69.22 62.55,80.01 | v62.55,69.22 60.96,70.8 | 60.96,70.8 60.96,59.05 57.15,59.05 57.15,58.26 61.91,58.26 | 61.91,69.53 61.91,58.26 | 12.7,46.67 v13.34,46.67 v13.34,41.91 12.7,41.91 | 12.7,41.91 v12.06,41.91 v12.06,46.67 12.7,46.67 | 12.7,46.67 12.7,41.91 | 62.55,80.01 62.23,80.01 61.91,79.69 61.91,73.66 v61.91,73.18 61.91,70.8 | v7.94,83.19 7.94,76.04 | v15.72,25.88 v15.72,29.05 v14.29,29.05 v14.29,27.46 v14.29,25.08 v15.72,25.08 v15.72,25.88 | 15.08,27.78 15.08,25.72 15.56,25.72 v15.72,25.88
  other vias: 22.86,73.98 22.86,71.44 29.21,69.53 29.21,71.44 44.45,27.94 27.94,40.96 25.4,39.37 46.04,72.39 46.04,70.48 47.62,78.11 50.96,78.11 28.89,88.27 32.07,87.95 30.48,67.31 25.08,66.99 25.72,64.45 43.81,93.03 39.69,82.87 38.42,77.15 38.42,74.61 35.56,74.61 33.97,74.61 35.24,59.37 36.51,66.36 31.43,63.5 32.07,85.72 33.66,85.41 35.88,87.31 33.97,79.06 33.97,83.5 33.66,81.28 31.75,81.92 31.75,80.01 31.43,75.88 28.89,78.74 29.53,81.92 40.96,90.49 39.05,28.89 38.73,26.35 38.73,23.81 41.91,24.92 45.72,26.67 46.99,25.4 43.81,23.02 25.08,70.48 22.86,68.58 25.08,68.9 31.75,71.12 22.07,18.73 22.54,20.32 34.29,93.34 34.29,97.16 40.64,98.11 35.56,98.42 36.51,57.78 36.51,56.2 41.91,56.52 39.69,60.64 36.51,60.33 34.29,62.23 33.02,59.37 33.02,62.55 31.11,59.37 30.48,60.33 30.48,63.18 29.21,63.18 29.21,60.01 25.72,62.23 28.89,58.1 25.72,57.78 31.11,58.1 33.02,58.1 32.07,57.15 31.11,55.88 34.61,55.56 30.8,53.02 30.8,50.8 29.21,52.7 35.56,48.9 33.02,46.35 32.38,48.26 30.8,46.04 27.62,45.4 24.29,44.77 24.13,47.31 24.13,49.21 25.56,42.86 22.54,50.8 23.18,52.39 22.54,53.98 22.23,56.2 22.23,57.78 22.23,60.96 23.5,60.96 23.5,62.23 23.5,59.37 23.5,57.15 22.23,62.23 54.29,20 53.5,20 53.66,18.73 54.45,18.73 55.56,19.37 54.77,19.37 53.98,19.37 56.67,29.21 52.7,20 53.18,19.37 55.24,18.73 56.04,18.73 57.15,19.37 56.83,18.73 56.36,19.37 43.81,39.69 43.81,40.64 43.81,41.59 43.81,42.55 43.81,43.5 43.81,44.45 43.81,45.4 43.81,46.35 43.18,46.99 44.13,47.31 44.45,46.04 44.45,45.09 44.45,44.13 44.45,43.18 44.45,42.23 44.45,41.27 44.45,40.32 45.09,39.69 45.09,40.96 45.09,41.91 45.09,42.86 45.09,43.81 45.09,44.77 45.09,45.72 45.09,46.67 45.09,47.62 41.91,35.24 41.91,36.2 41.91,37.15 41.91,38.1 41.91,39.05 41.91,40.01 41.91,40.96 41.91,41.91 41.91,42.86 41.91,43.81 41.91,44.77 41.59,45.72 40.96,46.35 40.32,46.99 40.96,44.45 40.96,43.5 40.96,42.55 40.96,41.59 40.96,40.64 40.96,39.69 40.96,38.73 40.96,37.78 41.27,36.83 40.96,35.88 40.64,45.4 37.15,40.96 37.15,35.88 37.15,38.42 32.7,40.64 34.61,40.96 32.7,39.69 34.92,39.69 30.8,39.37 30.8,38.42 30.8,37.47 30.8,36.51 30.8,35.56 29.84,37.15 29.84,36.2 29.84,35.24 30.48,34.61 29.84,33.97 28.89,33.97 28.89,35.24 28.89,36.2 28.89,37.15 27.94,37.15 26.99,36.83 27.94,36.2 27.94,35.24 27.94,34.29 26.99,33.97 26.99,34.92 26.99,35.88 26.35,36.2 26.35,35.24 26.35,34.29 26.19,32.23 26.99,32.23 28.57,32.23 29.37,31.91 30.48,31.75 31.11,31.27 30.48,30.8 29.84,31.27 30,32.38 27.78,32.23 30.48,29.84 23.81,31.91 22.54,28.42 22.54,27.46 23.5,27.94 23.81,31.11 22.86,31.11 22.23,30.48 23.18,30.48 24.13,30.48 24.29,27.94 23.5,29.84 22.54,29.84 22.23,29.21 23.18,29.21 23.81,28.73 24.77,23.81 23.81,24.13 22.86,24.13 22.23,23.81 23.81,34.77 22.23,35.72 22.23,34.92 23.02,34.92 23.81,35.56 23.02,35.72 22.23,36.51 23.5,36.51 22.86,37.15 22.23,37.78 13.34,45.88 13.34,45.09 13.34,44.29 13.34,43.5 12.06,43.5 12.06,44.29 12.06,45.09 12.06,45.88 6.99,62.87 7.94,62.87 6.99,82.23 7.94,82.23 44.45,62.55 39.53,63.5 43.66,57.94 36.67,83.03 38.26,84.61 41.43,85.72 38.73,91.28 32.86,91.44 32.38,96.2 28.57,95.89 28.42,93.34 28.73,85.57 31.75,69.69 29.05,66.2 32.7,55.56 42.23,54.93 43.81,52.7 47.47,52.23 48.1,50.48 47.31,56.52 46.83,58.9 49.05,61.28 50.01,58.58 48.1,62.71 46.2,62.23 46.2,64.93 44.13,65.09 44.61,67.63 43.66,70.48 44.13,72.39 48.1,69.85 47.94,66.83 52.07,74.61 52.55,79.85 49.85,79.22 47.62,76.36 47.47,80.8 52.39,81.44 28.73,98.27 38.89,87.63 40.48,88.9 62.07,68.1 61.59,67.15 61.59,66.2 61.59,65.25 61.59,63.34 61.59,64.29 60.33,59.21 59.69,58.9 59.05,59.21 58.42,58.9 57.78,59.21 57.15,58.9 56.52,59.21 55.88,58.9 55.24,59.21 54.61,58.9 53.98,59.21 53.34,63.18 53.34,65.25 53.34,66.04 53.34,66.83 53.34,67.63 53.34,68.42 52.86,69.06 52.7,69.85 53.02,70.64 53.34,71.44 53.34,72.23 53.34,73.03 53.34,73.82 53.34,74.61 53.34,76.52 53.34,77.31 53.34,78.11 53.34,78.9 53.34,79.69 52.55,79.06 52.55,78.26 51.75,78.11 15.72,27.46 15.72,26.67 14.29,25.88 14.29,26.67 53.34,62.39 53.34,61.59 53.34,60.8 53.34,60.01 53.18,59.21 52.7,64.61 52.7,63.82 59.05,58.42 60.33,58.42 59.69,58.1 58.42,58.1 61.59,58.1 61.59,59.37 62.07,58.74 62.55,59.37 62.07,60.01 61.91,72.39 61.91,71.6 62.55,72.71 62.55,71.91 62.55,71.12 56.2,22.86 8.1,70.01 6.83,70.01 7.46,70.48 8.1,70.96 6.83,70.96 7.46,71.44 8.1,71.91 6.83,71.91 7.46,72.39 7.46,69.53 6.83,73.66 7.46,73.98 8.1,73.66 8.1,74.45 6.83,74.45 7.46,74.77 7.62,76.2 7.62,76.99 7.46,77.79 6.83,78.26 8.1,78.26 7.62,78.9 7.62,79.69 6.83,80.33 7.46,80.64 8.1,80.33 6.83,81.28 7.46,81.6 8.1,81.28 12.06,42.7 13.34,42.7 14.29,28.26 15.72,28.26
  pour Top (no thermals): 0,13.97 5.56,13.97 10.32,18.73 15.56,18.73 20.32,13.97 31.75,13.97 31.75,0 70.17,0 70.17,100.01 59.37,100.01 59.37,90.17 60.64,90.17 60.64,59.53 53.66,59.53 53.66,82.55 44.77,82.55 44.77,100.01 0,100.01
  pour Bottom (no thermals): 26.04,100.01 26.04,75.25 21.91,75.25 21.91,18.41 57.47,18.41 57.47,59.53 53.98,59.53 53.98,82.55 44.77,82.55 44.77,100.01
  pour Bottom (no thermals): 60.64,100.01 70.17,100.01 70.17,80.01 60.64,80.01
HIN  (via drill 0.33)
  Top 0.254: v40.01,72.39 v36.2,72.39 | v35.88,80.01 v35.88,82.55 | v32.07,87 R42.1
  Top 0.305: U2.8 v29.84,20
  Bottom 0.254: v29.84,20 29.84,21.27 31.75,23.18 31.75,33.02 33.02,34.29 42.23,34.29 42.55,34.61 42.55,45.72 40.32,47.94 40.32,60.96 40.01,61.28 40.01,62.55 40.32,62.87 40.32,64.14 40.01,64.45 v40.01,72.39 | v36.2,72.39 36.2,79.69 v35.88,80.01 | v35.88,82.55 35.88,84.45 33.34,87 v32.07,87
HO  (via drill 0.33)
  Top 0.305: U2.3 v28.26,20
  Top 0.61: v28.26,20.8 v28.26,20
  Bottom 0.61: v28.26,20 v28.26,20.8 28.32,20.58 R17.1
HSTH  (via drill 0.33)
  Top 0.254: C41.1 36.81,46.04 | 36.81,46.04 R77.1 36.83,45.09 T1.2 | 36.81,46.04 37.47,46.04 38.1,46.67 38.1,48.26 37.78,48.58 37.78,54.93 v37.15,55.56 | v37.31,64.77 37.31,67.34 U18.1
  Bottom 0.254: v37.15,55.56 37.47,55.88 37.47,64.61 v37.31,64.77
HSTH2
  Top 0.254: C43.1 4.14,34.29 T2.2 R14.1 3.79,36.18 4.45,36.83 4.45,38.26 4.13,38.58 4.13,62.55 5.08,63.5 8.12,63.5 U15.3
I1SET
  Top 0.254: R61.1 12.37,79.69 R65.2 | 12.41,79.71 R65.2 | R65.2 R62.2 12.38,78.42
I1SET1
  Top 0.254: R28.1 12.37,24.13 R32.2 12.41,24.14 13.62,24.14 R31.2
I1SET2
  Top 0.254: R36.1 57.8,20.32 R46.2 56.55,20.34 R44.2
I1SET3
  Top 0.254: R52.1 60.96,69.86 | 60.96,69.86 60.96,69.83 | 60.96,69.83 R56.2 60.96,69.83 | 60.96,69.86 R57.2 60.96,69.83
IS1O
  Top 0.254: U1.6 52.69,94.58 R12.1
ISNS_REF  (via drill 0.33)
  Top 0.254: R11.1 v32.7,65.41 R10.2 | U9.1 50.63,80.8 | 50.63,80.8 C17.1 | U1.1 51.62,91.91 C11.1 51.44,93.66 50.8,94.3 47.62,94.3 47.31,93.98 TP5.1 45.72,93.98 v45.4,94.3 | 50.63,80.8 50.63,80.48 50.16,80.01 46.67,80.01 | 46.67,80.01 v45.72,80.01 | U17.A5 42.23,71.44 C28.1 35.23,71.45 33.97,72.71 v33.97,73.66 | v45.56,84.61 46.83,84.61 47.31,84.14 47.31,83.19 46.67,82.55 46.67,80.01
  Bottom 0.254: v45.72,80.01 45.09,80.01 44.13,79.06 44.13,73.34 U17.A5 | v45.4,94.3 45.4,84.77 v45.56,84.61 | v33.97,73.66 33.97,67.63 32.7,66.36 v32.7,65.41
LO
  Top 0.305: U2.10 32.97,21 33.18,20.8 33.18,20.22 R3.1
N$1  (via drill 0.33)
  Top 0.254: R76.2 v13.65,84.14 R75.2 | U11.3 15.08,75.56 v15.88,76.36
  Bottom 0.254: v15.88,76.36 15.88,80.64 13.65,82.87 v13.65,84.14
N$2
  Top 0.254: R29.2 3.97,23.35 | 3.97,23.35 R30.1 | 3.97,23.35 4.8,23.35 D2.K 6.62,23.79 U3.3
N$3  (via drill 0.33)
  Top 0.254: R18.2 v12.38,84.14 R19.2 | U11.5 19.05,74.3 18.41,74.93 v18.41,75.56
  Bottom 0.254: v18.41,75.56 15.24,75.56 14.61,76.2 14.61,80.64 12.38,82.87 v12.38,84.14
N$4  (via drill 0.33)
  Top 0.254: R20.2 v21.91,84.14 | v21.91,84.14 R21.1 | v21.91,84.14 22.54,84.14 22.86,83.82 22.86,81.6 22.54,81.28 22.54,76.52 21.59,75.56 U11.6
N$5
  Top 0.254: R38.2 66.04,21.1 | 66.04,21.1 R40.1 | 66.04,21.1 65.21,21.1 D3.K 63.39,20.66 U7.3
N$6
  Top 0.254: R54.2 65.89,75.1 D4.K | D4.K 66.08,76.22 R55.1 | D4.K 63.39,76.22 U8.3
N$7
  Top 1.016: L2.2 47.51,37.77 C18.1 56.91,37.77 L4.1 C26.+
N$8
  Top 0.61: U5.1 26.27,39.76 C25.1
N$9  (via drill 0.33)
  Top 0.254: R79.2 v20.64,84.14 R81.1 | v20.64,81.28 20.32,80.96 17.78,80.96 17.46,80.64 17.46,78.42 16.19,77.15 15.4,77.15 15.08,76.83 U11.2
  Bottom 0.254: v20.64,81.28 v20.64,84.14
N$10
  Top 0.61: R66.2 47.93,71.44 Q14.3 45.04,73.6 R60.2
N$12
  Top 0.61: D5.A 50.67,71 R6.2
N$13
  Bottom 1.016: J1.2 63.74,97.08 63.02,96.36 62.87,96.51 R22.1
N$14  (via drill 0.33)
  Top 0.61: Q13.2 Q12.2 46.67,75.56 v47.31,74.93 | R6.1 R49.2 52.07,71.75 v51.75,71.75
  Bottom 0.406: v47.31,74.93 47.94,75.56 49.21,75.56 49.85,74.93 49.85,72.39 50.48,71.75 v51.75,71.75
N$15  (via drill 0.33)
  Top 0.254: R84.2 R85.1 44.15,29.51 39.37,34.29 39.37,55.4 v39.53,55.56 | R83.2 39.37,56.99 v39.53,56.83
  Bottom 0.254: v39.53,56.83 v39.53,55.56
N$17
  Top 0.254: R70.1 47.96,82.55 51.59,82.55 U9.6
N$18
  Top 0.254: U5.3 28.89,38.72 R94.2 R93.1
N$19
  Top 0.305: U2.6 31.62,17.79 R86.2
N$23
  Top 0.61: R95.1 U5.4
N$24
  Top 0.254: U13.3 5.29,79.31 D11.K 4.64,78.75 R64.1 3.97,78.91 R63.2
N$26
  Top 0.254: R53.2 U17.A12
N$34
  Top 0.61: Q9.3 J2.2
NCSVCC
  Top 0.254: R71.1 C19.1 53.19,80.95 U9.3
NCSVCC2  (via drill 0.33)
  Top 0.254: U1.3 C14.1 53.99,90.5 v53.98,90.49 | v59.37,90.81 R73.2
  Bottom 0.254: v53.98,90.49 53.98,90.33 54.29,90.01 58.58,90.01 v59.37,90.81
OA1+
  Top 0.254: JP3.2 13.64,86.04 | R18.1 12.4,86.04 13.64,86.04 | 13.64,86.04 R75.1
OA1-
  Top 0.254: JP2.2 20.64,86.04 | 20.64,86.04 21.89,86.04 R20.1 | R79.1 20.64,86.04
PA8
  Top 0.254: U17.A8 R42.2 R80.1
PA9
  Top 0.254: U17.A9 R45.2 R4.1
PB5  (via drill 0.33)
  Top 0.254: U15.6 14.59,65.1 v14.61,65.09 | v15.88,65.09 16.51,65.09 16.83,65.41 24.77,65.41 26.04,66.67 U17.B5
  Bottom 0.254: v14.61,65.09 v15.88,65.09
PB12  (via drill 0.33)
  Top 0.254: U18.6 37.63,70 37.31,70.33 35.08,70.33 34.61,69.85 33.34,69.85 32.7,70.48 32.7,83.82 33.02,84.14 33.02,88.58 v33.34,88.9 | U17.B12 32.7,97.16 33.66,96.2 33.66,90.49 v34.29,89.85
  Bottom 0.254: v33.34,88.9 v34.29,89.85
Q7G
  Top 0.254: R43.1 67.88,82.87 Q2.1
Q7G1
  Top 0.254: R8.1 67.88,27.3 Q4.1
Q7G2
  Top 0.254: Q6.1 3.26,72.33 R26.1
Q7G3
  Top 0.254: Q5.1 3.26,16.77 R27.1
RS+  (via drill 0.33)
  Top 0.254: v14.61,87.31 14.29,87.63 14.29,89.53 13.97,89.85 12.38,89.85 10.08,92.16 J3.2
  Bottom 0.254: JP3.1 17.14,84.77 17.14,86.68 16.51,87.31 v14.61,87.31
RS-
  Top 0.254: JP2.1 17.14,84.77 17.14,89.22 16.51,89.85 15.88,89.85 15.56,90.17 15.56,93.03 14.29,94.3 6.35,94.3 5.24,95.41 J3.1
S1  (via drill 0.33)
  Top 0.254: U17.B9 v33.66,56.52 | v34.61,57.47 37.15,60.01 39.69,60.01 40.01,59.69 40.01,58.1 40.96,57.15 46.67,57.15 48.9,59.37 S1.1
  Bottom 0.254: v33.66,56.52 v34.61,57.47
S2
  Top 0.254: U17.C13 48.26,51.44 S2.1
SW5V
  Top 0.61: U5.6 26.27,42.16 C25.2 25.52,41.81 L3.1 24.13,43.18 23.97,43.34 D6.K
VBST
  Top 0.305: U2.2 26.39,20.5 C1.1
  Top 0.61: D1.K 25.45,22.65 25.72,22.38 C1.1
VGH
  Bottom 0.61: R17.2 33.91,23.12 J5.G1
VGL
  Top 0.61: R3.2 38.99,20.7 J5.G2
VMID  (via drill 0.33)
  Top 0.305: 28.57,19.21 28.1,19.21 27.8,19.5 U2.4 25.75,19.5 C1.2
  Top 0.406: 29.05,20.95 29.05,19.68 28.57,19.21
  Top 0.61: J5.S1 30.8,25.72 29.05,23.97 29.05,20.95
  Top 1.016: J5.D2 J5.S1 | L2.1 33.97,36.09 v33.97,32.7 v33.97,31.91
  Bottom 1.016: J5.S1 J5.D2 36.51,29.37 v33.97,31.91 v33.97,32.7
VS
  Top 0.254: 43.18,27.94 42.85,28.27 R85.2 42.21,28.27 40.96,28.57
  Top 1.016: 40.96,28.57 39.37,30.16 33.02,30.16 31.11,28.26 30.61,28.26 | 30.61,28.26 26.67,28.26 C7.+ | 30.61,28.26 C13.1 30.8,27.46 31.27,26.99 32.7,26.99 J5.D1
  Top 2.54: 40.96,28.57 61.52,8.02 J6.2

## Text on the board
tPlace: + RS - | R68 | R12 | U1 | C11 | + | C30 | Q3 | TRM | TRM | R37 | R67 | C14 | R80 | R73 | R42 | R39 | R5 | D9 | R18 | R75 | R79 | R20 | R4 | R24 | R45 | R43 | C31 | R61 | R19 | R76 | R81 | R21 | C20 | C17 | U9 | C22 | R59 | R65 | RMT | RMT | R16 | R69 | R70 | R58 | R63 | D11 | U13 | C34 | C33 | C19 | R71 | U8 | R64 | U11 | Q11 | C23 | Q13 | R62 | R53 | C50 | R60 | C6 | R82 | Q12 | Q10 | R55 | C15 | R78 | C51 | C24 | D4 | R50 | Q15 | R52 | R54 | R2 | C28 | R26 | U18 | Q14 | R66 | R57 | C38 | D5 | R49 | R7 | R25 | C9 | R6 | R56 | C42 | R10 | R13 | Q16 | R74 | C27 | S1 | U15 | U6 | R9 | C39 | R11 | R72 | R15 | R83 | C4 | TMP | R41 | S2 | C29 | R48 | LED7 | U16 | 5V | DI | C32 | C16 | C37 | GND | C41 | C35 | R77 | C45 | R95 | T1 | C25 | L2 | U5 | C18 | L3 | L4 | C46 | R93 | R94 | R14 | T2 | C13 | C43 | C26 | R23 | R85 | R84 | C8 | R8 | R28 | R32 | R51 | R29 | U3 | R31 | C7 | R30 | D2 | R47 | C3 | C2 | C10 | C12 | U2 | R46 | R40 | C5 | D1 | R44 | U7 | R33 | D3 | R35 | C1 | R3 | C21 | R36 | R38 | R27 | R86 | R1 | +FAN- | HV | Q9 | R34 | GND
bPlace: BAT+ | BAT- | 12V | R87 | R22 | GND | Q8 | Q7 | Q1 | Q17 | R17
tStop: CCR-HP v1.1 | justin kenny 2020